# Altium schematic sheet procesor i zasilanie.SchDoc
size A4; SheetNumber: 1; SheetTotal: 1
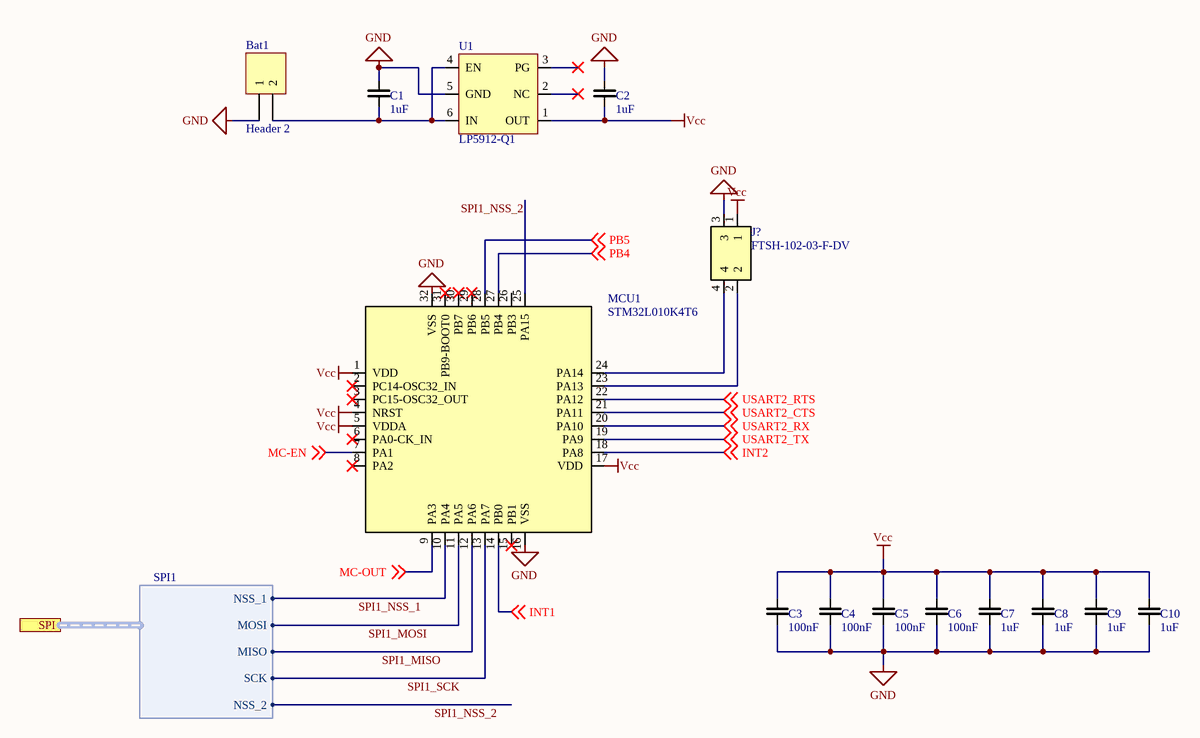
[diagram p0: procesor i zasilanie.SchDoc]

## Parts
Bat1  Header 2  [HDR1X2]
C1  1uF
C2  1uF
C3  100nF
C4  100nF
C5  100nF
C6  100nF
C7  1uF
C8  1uF
C9  1uF
C10  1uF
J?  FTSH-102-03-F-DV
MCU1  STM32L010K4T6
U1  LP5912-Q1

## Ports
SPI (harness SPI1)

## Harnesses
SPI1: NSS_1, MOSI, MISO, SCK, NSS_2

## Nets
GND: Bat1.1 C1.2 C2.2 C3.1 C4.1 C5.1 C6.1 C7.1 C8.1 C9.1 C10.1 J?.3 MCU1.16(VSS) MCU1.32(VSS) U1.5(GND)
Vcc: C2.1 C3.2 C4.2 C5.2 C6.2 C7.2 C8.2 C9.2 C10.2 J?.1 MCU1.1(VDD) MCU1.4(NRST) MCU1.5(VDDA) MCU1.17(VDD) U1.1(OUT)
INT1: MCU1.14(PB0) ; off-sheet INT1
INT2: MCU1.18(PA8) ; off-sheet INT2
MC-EN: MCU1.7(PA1) ; off-sheet MC-EN
MC-OUT: MCU1.9(PA3) ; off-sheet MC-OUT
PB4: MCU1.27(PB4) ; off-sheet PB4
PB5: MCU1.28(PB5) ; off-sheet PB5
SPI1_MISO: MCU1.12(PA6) ; port SPI.MISO
SPI1_MOSI: MCU1.11(PA5) ; port SPI.MOSI
SPI1_NSS_1: MCU1.10(PA4) ; port SPI.NSS_1
SPI1_NSS_2: MCU1.25(PA15) ; port SPI.NSS_2
SPI1_SCK: MCU1.13(PA7) ; port SPI.SCK
USART2_CTS: MCU1.21(PA11) ; off-sheet USART2_CTS
USART2_RTS: MCU1.22(PA12) ; off-sheet USART2_RTS
USART2_RX: MCU1.20(PA10) ; off-sheet USART2_RX
USART2_TX: MCU1.19(PA9) ; off-sheet USART2_TX
NetBat1_2: Bat1.2 C1.1 U1.4(EN) U1.6(IN)
NetJ?_2: J?.2 MCU1.23(PA13)
NetJ?_4: J?.4 MCU1.24(PA14)

Not connected (* = marked no-connect by the designer): MCU1 2(PC14-OSC32_IN)* 3(PC15-OSC32_OUT)* 6(PA0-CK_IN)* 8(PA2)* 15(PB1)* 26(PB3) 29(PB6)* 30(PB7)* 31(PB9-BOOT0)*; U1 2(NC)* 3(PG)*

## Library data of the parts
Bat1 = Header 2: Header, 2-Pin; LatestRevisionDate: 17-Jul-2002; LatestRevisionNote: Re-released for DXP Platform.; Publisher: Altium Limited
C1-C10 = Cap: Ceramic capacitor
J? = Pin_header 2x2
MCU1 = CPU32p
U1 = STAB